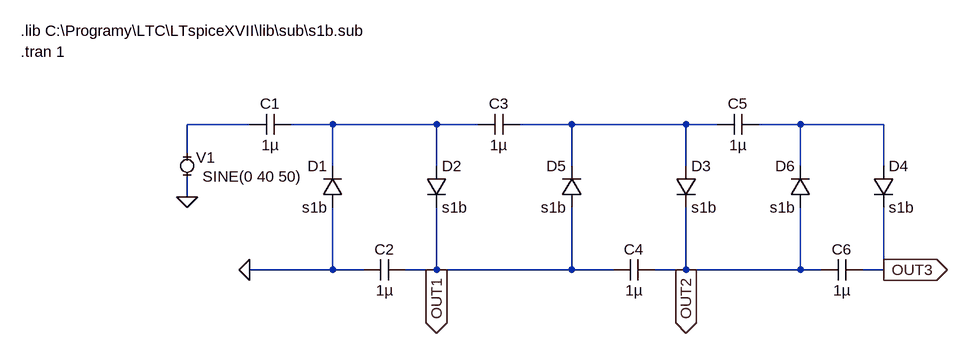
[diagram p0: schematic 8_Voltage_Multipl.asc]
8_Voltage_Multipl.asc, the LTspice schematic file:
Version 4
SHEET 1 1068 680
WIRE -32 80 -128 80
WIRE 96 80 32 80
WIRE 256 80 96 80
WIRE 320 80 256 80
WIRE 464 80 384 80
WIRE 640 80 464 80
WIRE 688 80 640 80
WIRE 816 80 752 80
WIRE 944 80 816 80
WIRE -128 128 -128 80
WIRE 96 144 96 80
WIRE 256 144 256 80
WIRE 464 144 464 80
WIRE 640 144 640 80
WIRE 816 144 816 80
WIRE 944 144 944 80
WIRE -128 192 -128 160
WIRE 96 304 96 208
WIRE 96 304 -32 304
WIRE 144 304 96 304
WIRE 256 304 256 208
WIRE 256 304 208 304
WIRE 464 304 464 208
WIRE 464 304 256 304
WIRE 528 304 464 304
WIRE 640 304 640 208
WIRE 640 304 592 304
WIRE 816 304 816 208
WIRE 816 304 640 304
WIRE 848 304 816 304
WIRE 944 304 944 208
WIRE 944 304 912 304
FLAG -32 304 0
FLAG 256 304 OUT1
IOPIN 256 304 Out
FLAG 640 304 OUT2
IOPIN 640 304 Out
FLAG 944 304 OUT3
IOPIN 944 304 Out
FLAG -128 192 0
SYMBOL cap -32 96 R270
WINDOW 0 32 32 VTop 2
WINDOW 3 0 32 VBottom 2
SYMATTR InstName C1
SYMATTR Value 1µ
SYMATTR SpiceLine V=100 Irms=4.58 Rser=0.025 Lser=0 mfg="KEMET" pn="C2225C105K1RAC" type="X7R"
SYMBOL diode 112 208 R180
WINDOW 0 24 64 Left 2
WINDOW 3 24 0 Left 2
SYMATTR InstName D1
SYMATTR Value s1b
SYMBOL cap 144 320 R270
WINDOW 0 32 32 VTop 2
WINDOW 3 0 32 VBottom 2
SYMATTR InstName C2
SYMATTR Value 1µ
SYMATTR SpiceLine V=100 Irms=4.58 Rser=0.025 Lser=0 mfg="KEMET" pn="C2225C105K1RAC" type="X7R"
SYMBOL cap 320 96 R270
WINDOW 0 32 32 VTop 2
WINDOW 3 0 32 VBottom 2
SYMATTR InstName C3
SYMATTR Value 1µ
SYMATTR SpiceLine V=100 Irms=4.58 Rser=0.025 Lser=0 mfg="KEMET" pn="C2225C105K1RAC" type="X7R"
SYMBOL cap 528 320 R270
WINDOW 0 32 32 VTop 2
WINDOW 3 0 32 VBottom 2
SYMATTR InstName C4
SYMATTR Value 1µ
SYMATTR SpiceLine V=100 Irms=4.58 Rser=0.025 Lser=0 mfg="KEMET" pn="C2225C105K1RAC" type="X7R"
SYMBOL cap 688 96 R270
WINDOW 0 32 32 VTop 2
WINDOW 3 0 32 VBottom 2
SYMATTR InstName C5
SYMATTR Value 1µ
SYMATTR SpiceLine V=100 Irms=4.58 Rser=0.025 Lser=0 mfg="KEMET" pn="C2225C105K1RAC" type="X7R"
SYMBOL cap 848 320 R270
WINDOW 0 32 32 VTop 2
WINDOW 3 0 32 VBottom 2
SYMATTR InstName C6
SYMATTR Value 1µ
SYMATTR SpiceLine V=100 Irms=4.58 Rser=0.025 Lser=0 mfg="KEMET" pn="C2225C105K1RAC" type="X7R"
SYMBOL diode 240 144 R0
SYMATTR InstName D2
SYMATTR Value s1b
SYMBOL diode 624 144 R0
SYMATTR InstName D3
SYMATTR Value s1b
SYMBOL diode 928 144 R0
SYMATTR InstName D4
SYMATTR Value s1b
SYMBOL diode 480 208 R180
WINDOW 0 24 64 Left 2
WINDOW 3 24 0 Left 2
SYMATTR InstName D5
SYMATTR Value s1b
SYMBOL diode 832 208 R180
WINDOW 0 24 64 Left 2
WINDOW 3 24 0 Left 2
SYMATTR InstName D6
SYMATTR Value s1b
SYMBOL MiniSyms4\\voltage- -128 144 R0
WINDOW 0 14 -13 Left 2
WINDOW 123 11 39 Left 2
WINDOW 39 0 0 Left 2
SYMATTR InstName V1
SYMATTR Value SINE(0 40 50)
TEXT -384 -64 Left 2 !.lib C:\\Programy\\LTC\\LTspiceXVII\\lib\\sub\\s1b.sub
TEXT -384 -32 Left 2 !.tran 1

The netlist it stands for:
* 8_Voltage_Multipl.asc
C1 N001 N002 1µ V=100 Irms=4.58 Rser=0.025 Lser=0 mfg="KEMET" pn="C2225C105K1RAC" type="X7R"
D1 0 N002 s1b
C2 0 OUT1 1µ V=100 Irms=4.58 Rser=0.025 Lser=0 mfg="KEMET" pn="C2225C105K1RAC" type="X7R"
C3 N002 N003 1µ V=100 Irms=4.58 Rser=0.025 Lser=0 mfg="KEMET" pn="C2225C105K1RAC" type="X7R"
C4 OUT1 OUT2 1µ V=100 Irms=4.58 Rser=0.025 Lser=0 mfg="KEMET" pn="C2225C105K1RAC" type="X7R"
C5 N003 N004 1µ V=100 Irms=4.58 Rser=0.025 Lser=0 mfg="KEMET" pn="C2225C105K1RAC" type="X7R"
C6 OUT2 OUT3 1µ V=100 Irms=4.58 Rser=0.025 Lser=0 mfg="KEMET" pn="C2225C105K1RAC" type="X7R"
D2 N002 OUT1 s1b
D3 N003 OUT2 s1b
D4 N004 OUT3 s1b
D5 OUT1 N003 s1b
D6 OUT2 N004 s1b
V1 N001 0 SINE(0 40 50)
.model D D
.lib standard.dio
.lib C:\Programy\LTC\LTspiceXVII\lib\sub\s1b.sub
.tran 1
.backanno
.end